# EAGLE schematic Board_1_ (EAGLE 8.7.0)

## Sheet 1 of 3
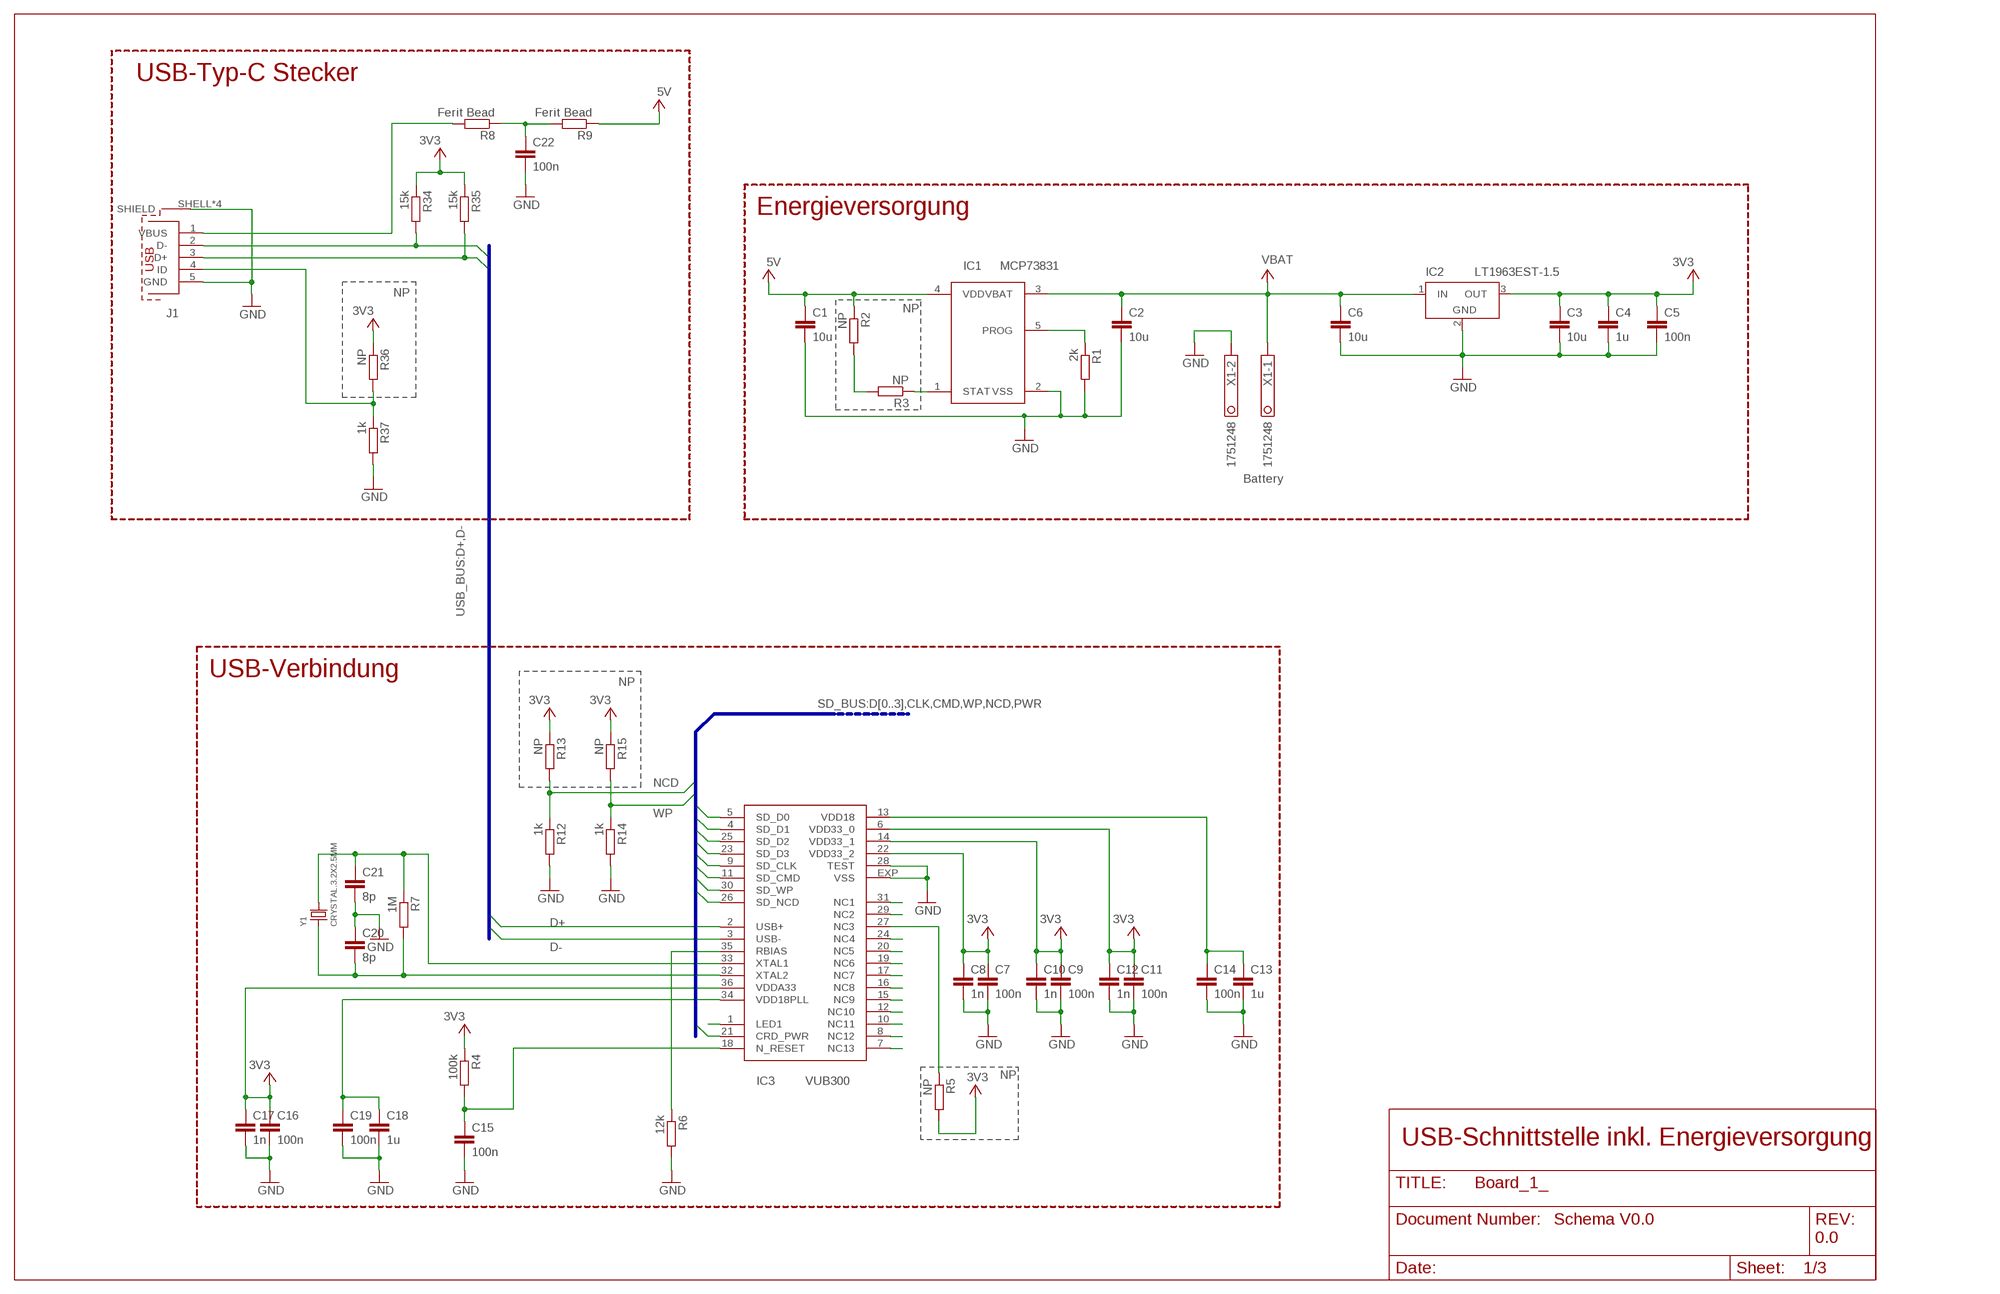
[diagram p0: schematic, sheet 1]

### Parts
C1  10u  C-EUC0805  [C0805]
C2  10u  C-EUC0805  [C0805]
C3  10u  C-EUC0805  [C0805]
C4  1u  C-EUC0603  [C0603]
C5  100n  C-EUC0603  [C0603]
C6  10u  C-EUC0805  [C0805]
C7  100n  C-EUC0402  [C0402]
C8  1n  C-EUC0402  [C0402]
C9  100n  C-EUC0402  [C0402]
C10  1n  C-EUC0402  [C0402]
C11  100n  C-EUC0402  [C0402]
C12  1n  C-EUC0402  [C0402]
C13  1u  C-EUC0402  [C0402]
C14  100n  C-EUC0402  [C0402]
C15  100n  C-EUC0402  [C0402]
C16  100n  C-EUC0402  [C0402]
C17  1n  C-EUC0402  [C0402]
C18  1u  C-EUC0402  [C0402]
C19  100n  C-EUC0402  [C0402]
C20  8p  C-EUC0402  [C0402]
C21  8p  C-EUC0402  [C0402]
C22  100n  C-EUC0603  [C0603]
IC1  MCP73831  [SOT23-5]
IC2  LT1963EST-1.5  [SOT223]
IC3  VUB300  [QFN36-6X6]
J1  629105136821  [629105136821]
R1  2k  R-EU_R0603  [R0603]
R2  NP  R-EU_R0603  [R0603]
R3  NP  R-EU_R0603  [R0603]
R4  100k  R-EU_R0402  [R0402]
R5  NP  R-EU_R0402  [R0402]
R6  12k  R-EU_R0402  [R0402]
R7  1M  R-EU_R0402  [R0402]
R8  Ferit Bead  R-EU_R0603  [R0603]
R9  Ferit Bead  R-EU_R0603  [R0603]
R12  1k  R-EU_R0603  [R0603]
R13  NP  R-EU_R0603  [R0603]
R14  1k  R-EU_R0603  [R0603]
R15  NP  R-EU_R0603  [R0603]
R34  15k  R-EU_R0402  [R0402]
R35  15k  R-EU_R0402  [R0402]
R36  NP  R-EU_R0603  [R0603]
R37  1k  R-EU_R0603  [R0603]
X1  1751248  [1751248]
Y1  CRYSTAL.3.2X2.5MM  [3.2X2.5MM]

### Nets
+3V3: C3.1 C4.1 C5.1 C7.1 C8.1 C9.1 C10.1 C11.1 C12.1 C16.1 C17.1 IC2.3(OUT) IC3.6(VDD33_0) IC3.14(VDD33_1) IC3.22(VDD33_2) IC3.36(VDDA33) R4.1 R5.2 R13.1 R15.1 R34.1 R35.1 R36.1 ; supply symbol labelled 3V3 ; also sheet 2,3
+5V: C1.1 IC1.4(VDD) R2.1 R9.1 ; supply symbol labelled 5V
CLK: IC3.9(SD_CLK) ; also sheet 2
CMD: IC3.11(SD_CMD) ; also sheet 2
D0: IC3.5(SD_D0) ; also sheet 2
D1: IC3.4(SD_D1) ; also sheet 2
D2: IC3.25(SD_D2) ; also sheet 2
D3: IC3.23(SD_D3) ; also sheet 2
D+: IC3.2(USB+) J1.3(D+) R35.2
D-: IC3.3(USB-) J1.2(D-) R34.2
GND: C1.2 C2.2 C3.2 C4.2 C5.2 C6.2 C7.2 C8.2 C9.2 C10.2 C11.2 C12.2 C13.2 C14.2 C15.2 C16.2 C17.2 C18.2 C19.2 C20.1 C21.2 C22.2 IC1.2(VSS) IC2.2(GND) IC3.28(TEST) IC3.EXP(VSS) J1.5(GND) J1.SHELL1(SHIELD) J1.SHELL2(SHIELD) J1.SHELL3(SHIELD) J1.SHELL(SHIELD) R1.2 R6.2 R12.2 R14.2 R37.2 X1.2 ; also sheet 2,3
N$1: IC1.5(PROG) R1.1
N$2: R2.2 R3.2
N$3: IC1.1(STAT) R3.1
N$4: IC3.1(LED1)
N$5: J1.4(ID) R36.2 R37.1
N$19: IC3.8(NC12)
N$20: IC3.7(NC13)
N$21: IC3.10(NC11)
N$22: IC3.12(NC10)
N$23: IC3.24(NC4)
N$24: IC3.15(NC9)
N$25: IC3.16(NC8)
N$26: IC3.17(NC7)
N$27: C15.1 IC3.18(N_RESET) R4.2
N$28: IC3.27(NC3) R5.1
N$29: IC3.19(NC6)
N$30: IC3.20(NC5)
N$31: IC3.35(RBIAS) R6.1
N$32: IC3.29(NC2)
N$33: IC3.31(NC1)
N$34: J1.1(VBUS) R8.2
N$35: C20.2 IC3.32(XTAL2) R7.2 Y1.1
N$36: C21.1 IC3.33(XTAL1) R7.1 Y1.3
N$37: C22.1 R8.1 R9.2
NCD: IC3.26(SD_NCD) R12.1 R13.2
PWR: IC3.21(CRD_PWR) ; also sheet 2
V+: C2.1 C6.1 IC1.3(VBAT) IC2.1(IN) X1.1 ; supply symbol labelled VBAT ; also sheet 3
VDD18: C13.1 C14.1 IC3.13(VDD18)
VDD18PLL: C18.1 C19.1 IC3.34(VDD18PLL)
WP: IC3.30(SD_WP) R14.1 R15.2

### Buses
SD_BUS:D[0..3],CLK,CMD,WP,NCD,PWR
USB_BUS:D+,D-

### Notes on the sheet
- USB-Typ-C Stecker
- Energieversorgung
- NP
- NP
- Battery
- USB-Verbindung | NP
- NP
- USB-Schnittstelle inkl. Energieversorgung
- Schema V0.0
- 0.0

## Sheet 2 of 3
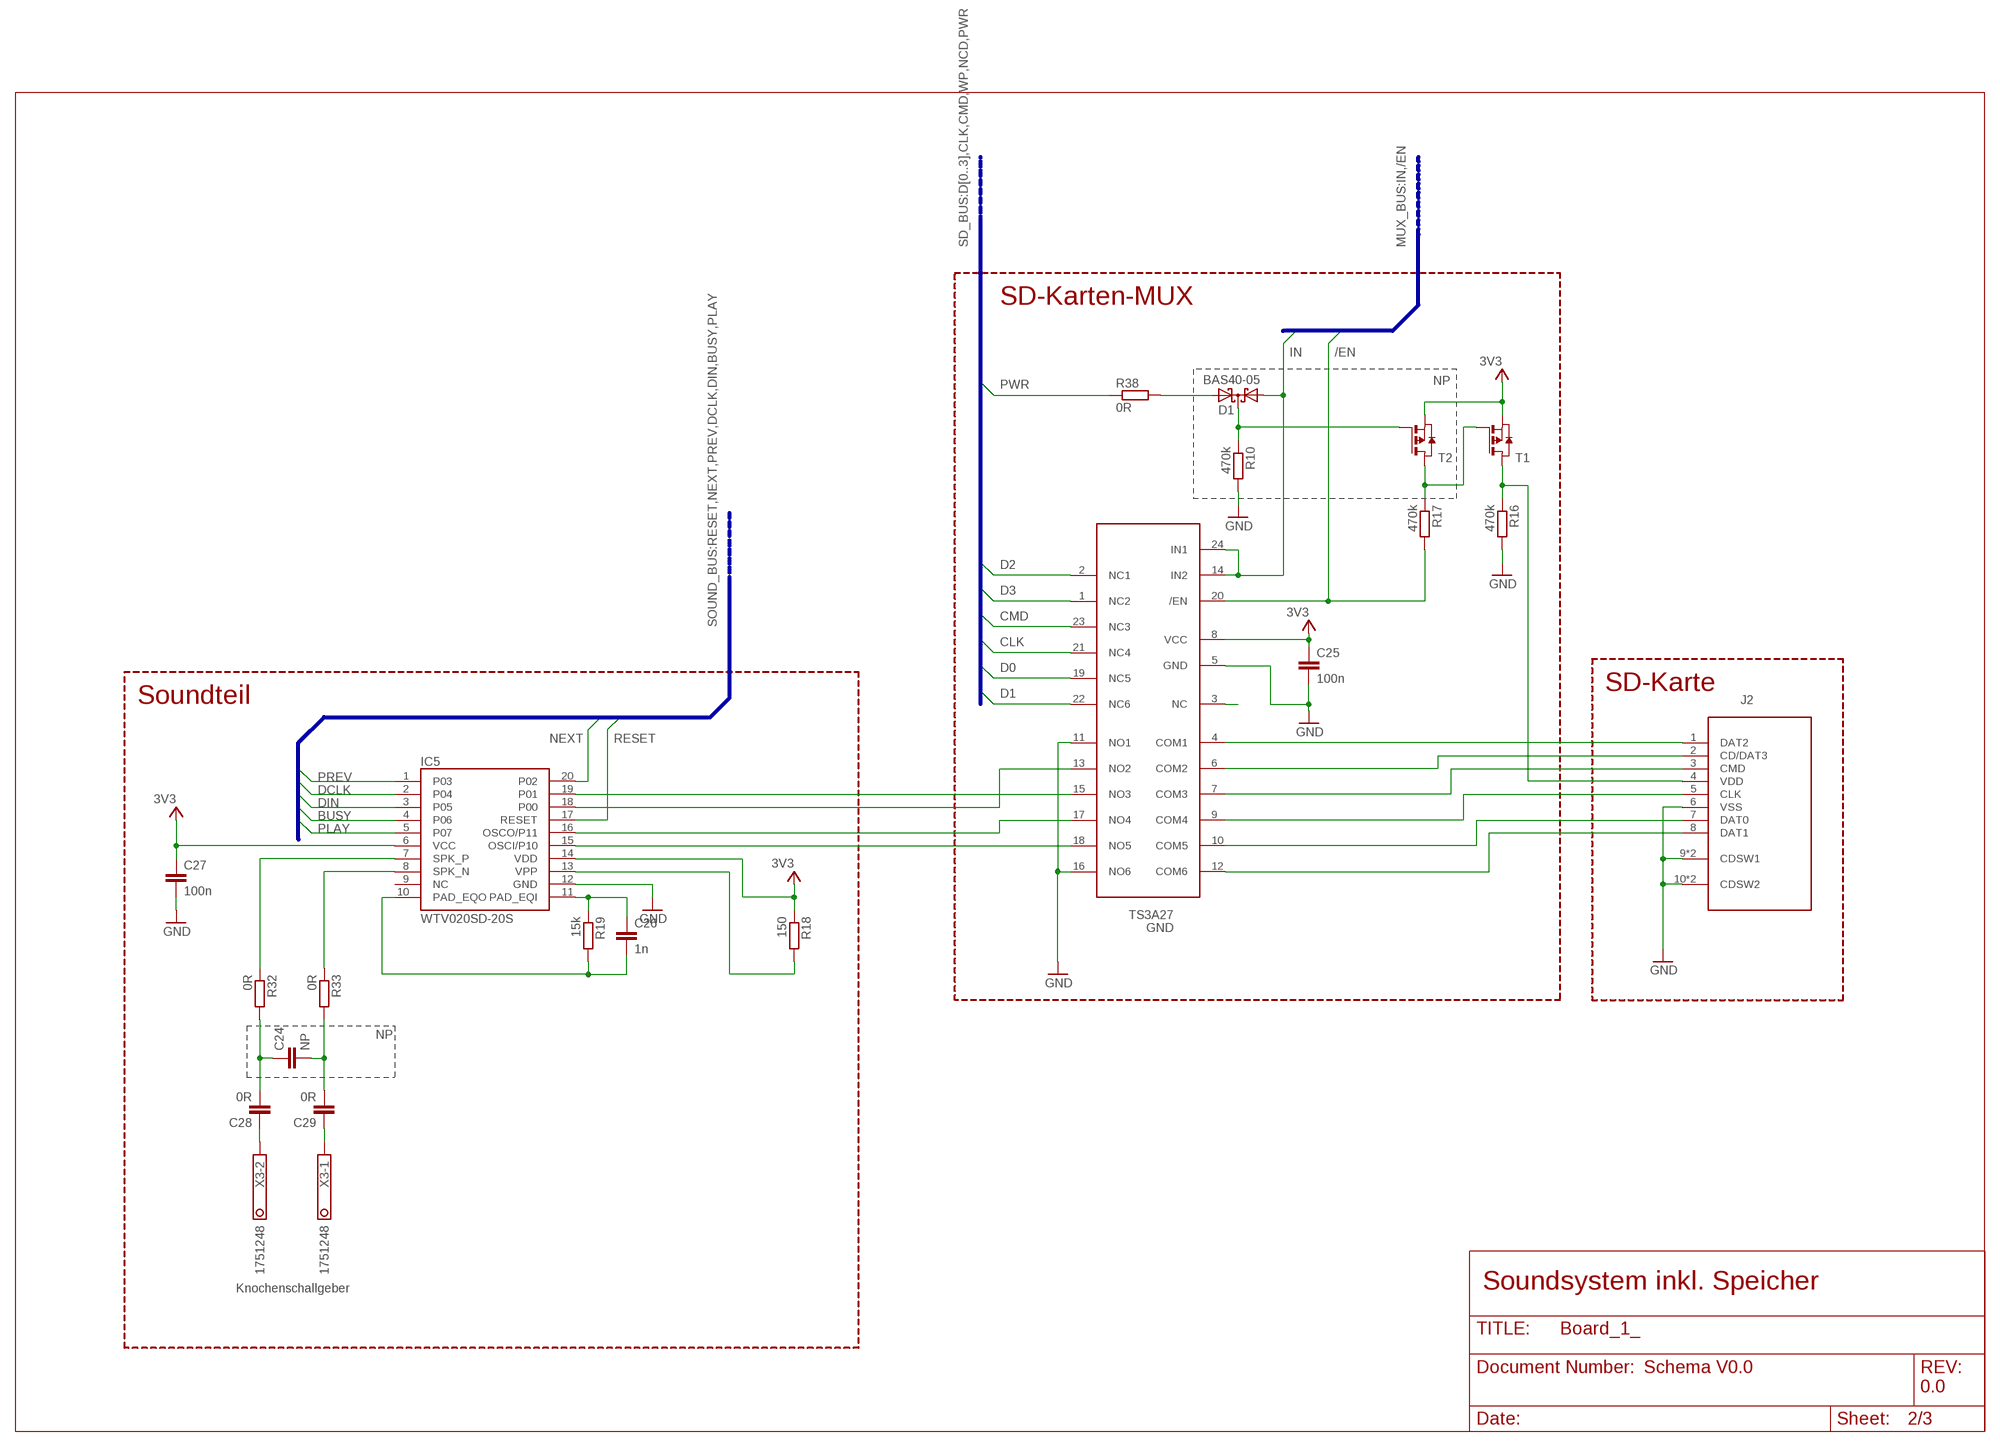
[diagram p1: schematic, sheet 2]

### Parts
C24  NP  C-EUC0603  [C0603]
C25  100n  C-EUC0603  [C0603]
C26  1n  C-EUC0603  [C0603]
C27  100n  C-EUC0603  [C0603]
C28  0R  C-EUC0603  [C0603]
C29  0R  C-EUC0603  [C0603]
D1  BAS40-05  [SOT23]
GND  TS3A27  [TSSOP24]
IC5  WTV020SD-20S  WTV020SD  [SSOP_20]
J2  693071010811  [693071010811]
R10  470k  R-EU_R0603  [R0603]
R16  470k  R-EU_R0603  [R0603]
R17  470k  R-EU_R0603  [R0603]
R18  150  R-EU_R0603  [R0603]
R19  15k  R-EU_R0603  [R0603]
R32  0R  R-EU_R0603  [R0603]
R33  0R  R-EU_R0603  [R0603]
R38  0R  R-EU_MELF0102W  [MINI_MELF-0102W]
T1  PMOSSOT23  [SOT-23]
T2  PMOSSOT23  [SOT-23]
X3  1751248  [1751248]

### Nets
+3V3: C25.1 C27.1 GND.8(VCC) IC5.6(VCC) IC5.14(VDD) R18.1 T1.2(S) T2.2(S) ; supply symbol labelled 3V3 ; also sheet 1,3
/EN: GND.20(/EN) R17.2 ; also sheet 3
BUSY: IC5.4(P06) ; also sheet 3
CLK: GND.21(NC4) ; also sheet 1
CMD: GND.23(NC3) ; also sheet 1
D0: GND.19(NC5) ; also sheet 1
D1: GND.22(NC6) ; also sheet 1
D2: GND.2(NC1) ; also sheet 1
D3: GND.1(NC2) ; also sheet 1
DCLK: IC5.2(P04) ; also sheet 3
DIN: IC5.3(P05) ; also sheet 3
GND: C25.2 C27.2 GND.5(GND) GND.11(NO1) GND.16(NO6) IC5.12(GND) J2.6(VSS) J2.9(CDSW1) J2.9-1(CDSW1) J2.10(CDSW2) J2.10-1(CDSW2) R10.2 R16.2 ; also sheet 1,3
IN: D1.1(A1) GND.14(IN2) GND.24(IN1) ; also sheet 3
N$8: D1.2(A2) R38.2
N$9: GND.15(NO3) IC5.19(P01)
N$38: GND.9(COM4) J2.5(CLK)
N$39: IC5.13(VPP) R18.2
N$40: C26.1 IC5.11(PAD_EQI) R19.1
N$41: GND.17(NO4) IC5.16(OSCO/P11)
N$42: GND.18(NO5) IC5.15(OSCI/P10)
N$43: GND.4(COM1) J2.1(DAT2)
N$44: GND.12(COM6) J2.8(DAT1)
N$45: GND.6(COM2) J2.2(CD/DAT3)
N$46: R17.1 T1.3(G) T2.1(D)
N$47: GND.3(NC)
N$49: D1.3(C) R10.1 T2.3(G)
N$56: C28.1 X3.2
N$57: C29.1 X3.1
N$58: C24.2 C29.2 R33.2
N$59: C24.1 C28.2 R32.2
NCD1: J2.4(VDD) R16.1 T1.1(D)
NEXT: IC5.20(P02) ; also sheet 3
PLAY: IC5.5(P07) ; also sheet 3
PREV: IC5.1(P03) ; also sheet 3
PWM: C26.2 IC5.10(PAD_EQO) R19.2
PWR: R38.1 ; also sheet 1
RESET: IC5.17(RESET) ; also sheet 3
SDCS: GND.13(NO2) IC5.18(P00)
SDDI: GND.7(COM3) J2.3(CMD)
SDDO: GND.10(COM5) J2.7(DAT0)
SPK+: IC5.7(SPK_P) R32.1
SPK-: IC5.8(SPK_N) R33.1
Unconnected: IC5.9(NC)

### Buses
SD_BUS:D[0..3],CLK,CMD,WP,NCD,PWR
MUX_BUS:IN,/EN
SOUND_BUS:RESET,NEXT,PREV,DCLK,DIN,BUSY,PLAY

### Notes on the sheet
- SD-Karten-MUX
- NP
- SD-Karte
- Soundteil
- NP
- Knochenschallgeber
- Soundsystem inkl. Speicher
- Schema V0.0
- 0.0

## Sheet 3 of 3
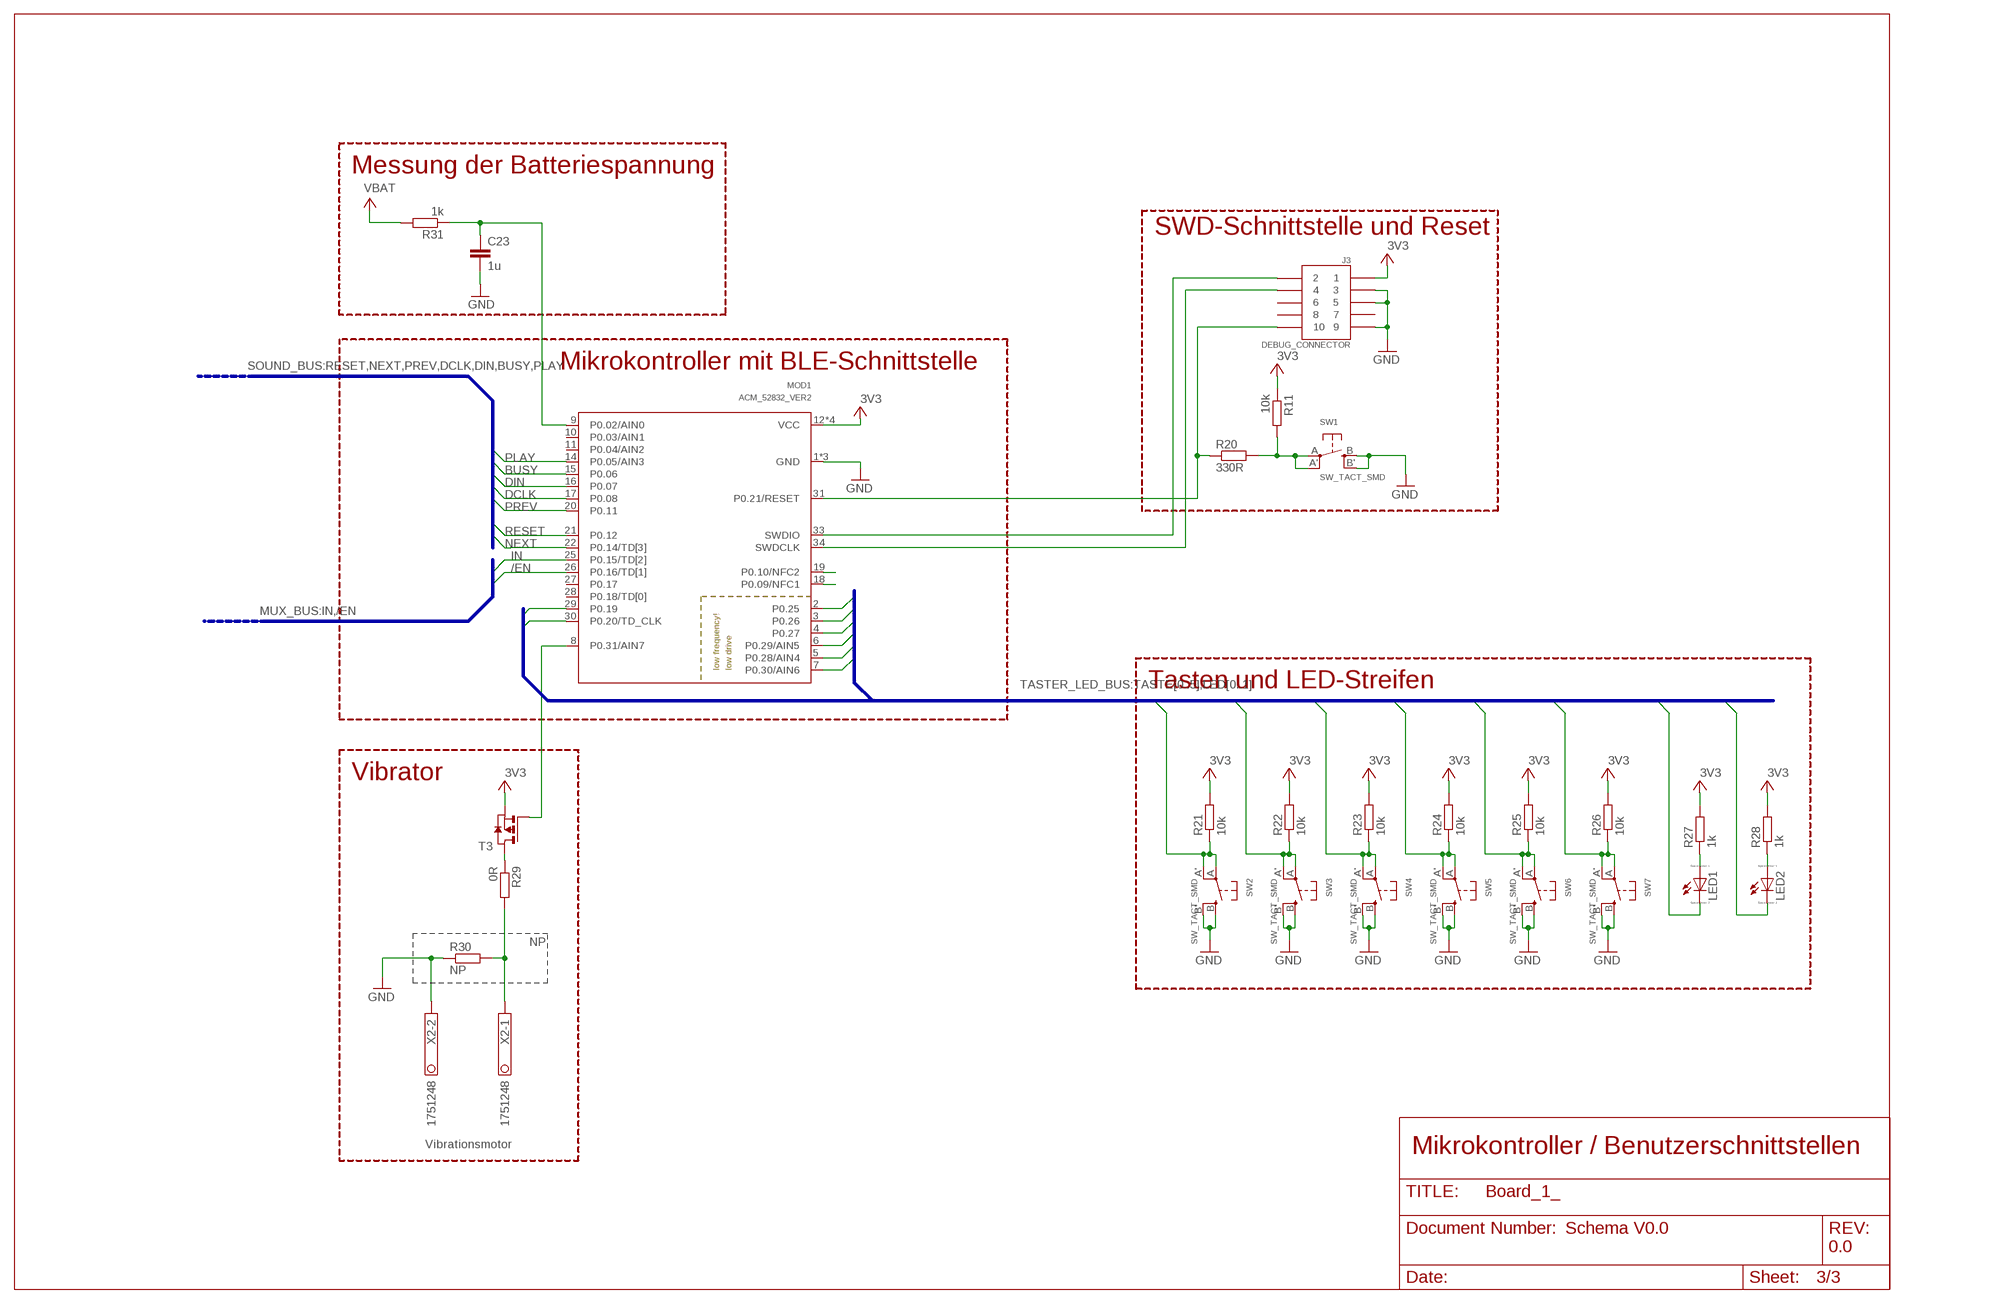
[diagram p2: schematic, sheet 3]

### Parts
C23  1u  C-EUC0603  [C0603]
J3  DEBUG_CONNECTOR  [HDRV127P5X2-10_N]
LED1  LED_E  [LED_1206]
LED2  LED_E  [LED_1206]
MOD1  ACM_52832_VER2  [ACONNO_ACM_52832]
R11  10k  R-EU_R0603  [R0603]
R20  330R  R-EU_R0603  [R0603]
R21  10k  R-EU_R0603  [R0603]
R22  10k  R-EU_R0603  [R0603]
R23  10k  R-EU_R0603  [R0603]
R24  10k  R-EU_R0603  [R0603]
R25  10k  R-EU_R0603  [R0603]
R26  10k  R-EU_R0603  [R0603]
R27  1k  R-EU_R0603  [R0603]
R28  1k  R-EU_R0603  [R0603]
R29  0R  R-EU_R0603  [R0603]
R30  NP  R-EU_R0603  [R0603]
R31  1k  R-EU_R0603  [R0603]
SW1  SW_TACT_SMD  [EVQ-Q2]
SW2  SW_TACT_SMD  [EVQ-Q2]
SW3  SW_TACT_SMD  [EVQ-Q2]
SW4  SW_TACT_SMD  [EVQ-Q2]
SW5  SW_TACT_SMD  [EVQ-Q2]
SW6  SW_TACT_SMD  [EVQ-Q2]
SW7  SW_TACT_SMD  [EVQ-Q2]
T3  PMOSSOT23  [SOT-23]
X2  1751248  [1751248]

### Nets
+3V3: J3.1 MOD1.12(VCC) MOD1.23(VCC) MOD1.24(VCC) MOD1.32(VCC) R11.1 R21.2 R22.2 R23.2 R24.2 R25.2 R26.2 R27.2 R28.2 T3.2(S) ; supply symbol labelled 3V3 ; also sheet 1,2
/EN: MOD1.26(P0.16/TD[1]) ; also sheet 2
BUSY: MOD1.15(P0.06) ; also sheet 2
DCLK: MOD1.17(P0.08) ; also sheet 2
DIN: MOD1.16(P0.07) ; also sheet 2
GND: C23.2 J3.3 J3.5 J3.9 MOD1.1(GND) MOD1.13(GND) MOD1.35(GND) R30.1 SW1.B'(S1) SW1.B(S) SW2.B'(S1) SW2.B(S) SW3.B'(S1) SW3.B(S) SW4.B'(S1) SW4.B(S) SW5.B'(S1) SW5.B(S) SW6.B'(S1) SW6.B(S) SW7.B'(S1) SW7.B(S) X2.2 ; also sheet 1,2
IN: MOD1.25(P0.15/TD[2]) ; also sheet 2
LED0: LED1.C MOD1.29(P0.19)
LED1: LED2.C MOD1.30(P0.20/TD_CLK)
N$6: MOD1.19(P0.10/NFC2)
N$7: MOD1.18(P0.09/NFC1)
N$48: R11.2 R20.2 SW1.A'(P1) SW1.A(P)
N$50: J3.4 MOD1.34(SWDCLK)
N$52: J3.10 MOD1.31(P0.21/RESET) R20.1
N$53: J3.2 MOD1.33(SWDIO)
N$54: LED1.A R27.1
N$55: C23.1 MOD1.9(P0.02/AIN0) R31.1
N$61: LED2.A R28.1
N$63: R29.2 R30.2 X2.1
N$64: MOD1.8(P0.31/AIN7) T3.3(G)
N$65: R29.1 T3.1(D)
NEXT: MOD1.22(P0.14/TD[3]) ; also sheet 2
PLAY: MOD1.14(P0.05/AIN3) ; also sheet 2
PREV: MOD1.20(P0.11) ; also sheet 2
RESET: MOD1.21(P0.12) ; also sheet 2
TASTE0: MOD1.7(P0.30/AIN6) R21.1 SW2.A'(P1) SW2.A(P)
TASTE1: MOD1.5(P0.28/AIN4) R22.1 SW3.A'(P1) SW3.A(P)
TASTE2: MOD1.6(P0.29/AIN5) R23.1 SW4.A'(P1) SW4.A(P)
TASTE3: MOD1.4(P0.27) R24.1 SW5.A'(P1) SW5.A(P)
TASTE4: MOD1.3(P0.26) R25.1 SW6.A'(P1) SW6.A(P)
TASTE5: MOD1.2(P0.25) R26.1 SW7.A'(P1) SW7.A(P)
V+: R31.2 ; supply symbol labelled VBAT ; also sheet 1
Unconnected: J3.6 J3.7 J3.8 MOD1.10(P0.03/AIN1) MOD1.11(P0.04/AIN2) MOD1.27(P0.17) MOD1.28(P0.18/TD[0])

### Buses
SOUND_BUS:RESET,NEXT,PREV,DCLK,DIN,BUSY,PLAY
MUX_BUS:IN,/EN
TASTER_LED_BUS:TASTE[0..5],LED[0..1]

### Notes on the sheet
- Messung der Batteriespannung
- SWD-Schnittstelle und Reset
- Mikrokontroller mit BLE-Schnittstelle
- Tasten und LED-Streifen
- Vibrator
- NP
- Vibrationsmotor
- Mikrokontroller / Benutzerschnittstellen
- Schema V0.0
- 0.0

## Power pins joined to a net without a drawn wire
GND: IC2.4(GND)

## Library data of the parts
C1-C29 = rcl:C-EU: CAPACITOR, European symbol; SPICEPREFIX: C
D1 = diode:BAS40-05: Silicon Schottky Diodes General-purpose diode for high-speed switching
GND = TS3a27:TS3A27
IC1 = mcp73831:MCP73831
IC2 = linear-technology:LT1963EST: 1.5A, Low Noise, Fast Transient Response LDO Regulator Source: http://www.linear.com/pc/downloadDocument.do?navId=H0,C3,P2222,D3148; MPN: LT1963EST-1.5; OC_FARNELL: 1663528; OC_NEWARK: 57M7534
IC3 = VUB300:VUB300
IC5 = SparkFun-DigitalIC:WTV020SD: SD audio playback IC Can play back .wav or .ad4 files from an SD card SPI control or digital input trigger control available in SSOP-20 or DIP-20; PROD_#: NA; PROD_ID: IC-11012; SKU: NA; SPARKLE_ID: 6000
J1 = USBZueg:629105136821: WR-COM SMT Horizontal 5 Contacts Micro USB Type B,5 pins=>Code : Con_I-O_COM_MicroUSB_629105136821 <http://katalog.we-online.de/media/images/eican/Con_I-O_COM_MicroUSB_629105136821_pf2.jpg> Details see: http://katalog.we-online.de/en/em/COM_MICRO_SMT_TYPE_B_HORIZONTAL/629105136821?m Created 2014-07-09, Karrer Zheng 2014 (C) Würth Elektronik
J2 = InputOutputIO (rev18a)(1):693071010811: WR-CRD MICRO SD CARD CONNECTOR PUSH & PUSH WITH CARD DETECTION 8PINS=>Code : Con_I-O_COM_CRD_SD_Micro_693071010811 <http://katalog.we-online.de/media/images/eican/Con_I-O_COM_CRD_SD_Micro_693071010811_pf2.jpg> Details see: http://katalog.we-online.de/en/em/CRD_SD_MICRO_PUSH_AND_PULL_8_PINS/693071010811 Created 2014-07-09, Karrer Zheng 2014 (C) Würth Elektronik
J3 = Nordic_misc:DEBUG_CONNECTOR
LED1 LED2 = eagle-ltspice:LED_E: LED Source: http://www.osram.convergy.de Source: www.luxeon.com Source: www.kingbright.com; SPICEMODEL: NONE; SPICEPREFIX: D; SPICETYPE: diode
MOD1 = acn52832_eagle:ACM_52832_VER2: Aconno BLE 2,4 GHz Module nRF52832 based
R1-R38 = resistor:R-EU_: RESISTOR, European symbol
SW1-SW7 = Pro3E:SW_TACT_SMD
T1-T3 = zetex:PMOSSOT23: MOS FET; OC_FARNELL: unknown; OC_NEWARK: unknown
X1-X3 = con-phoenix-350:1751248: MKDS 1/ 2-3,5 Printklemme Nennstrom: 10 A Bemessungsspannung: 160 V Raster: 3,5 mm Polzahl: 2 Montageart: Löten Anschlussart: Schraubanschluss Anschlussrichtung vom Leiter zur Platine: 0° Source: http://eshop.phoenixcontact.com .. 1751248.pdf; OC_FARNELL: unknown; OC_NEWARK: unknown
Y1 = abracom:CRYSTAL